# Altium schematic sheet Sheet2.SchDoc
size A4; SheetNumber: 1; SheetTotal: 1; SPICEModelCacheLWHNMWQJ: <root> / <DocumentId>LWHNMWQJ</DocumentId> / <CacheFrame Number="0"> / <Model Name="zener" Kind="MDL"> / <Text>*ZENER / *Default Zener 10V @ 10mA / *Zener Diode Pinout: A,K / .MODEL ZENER D( BV=10 IBV=10E-3 )</Text> / </Model> / </CacheFrame> / </root>
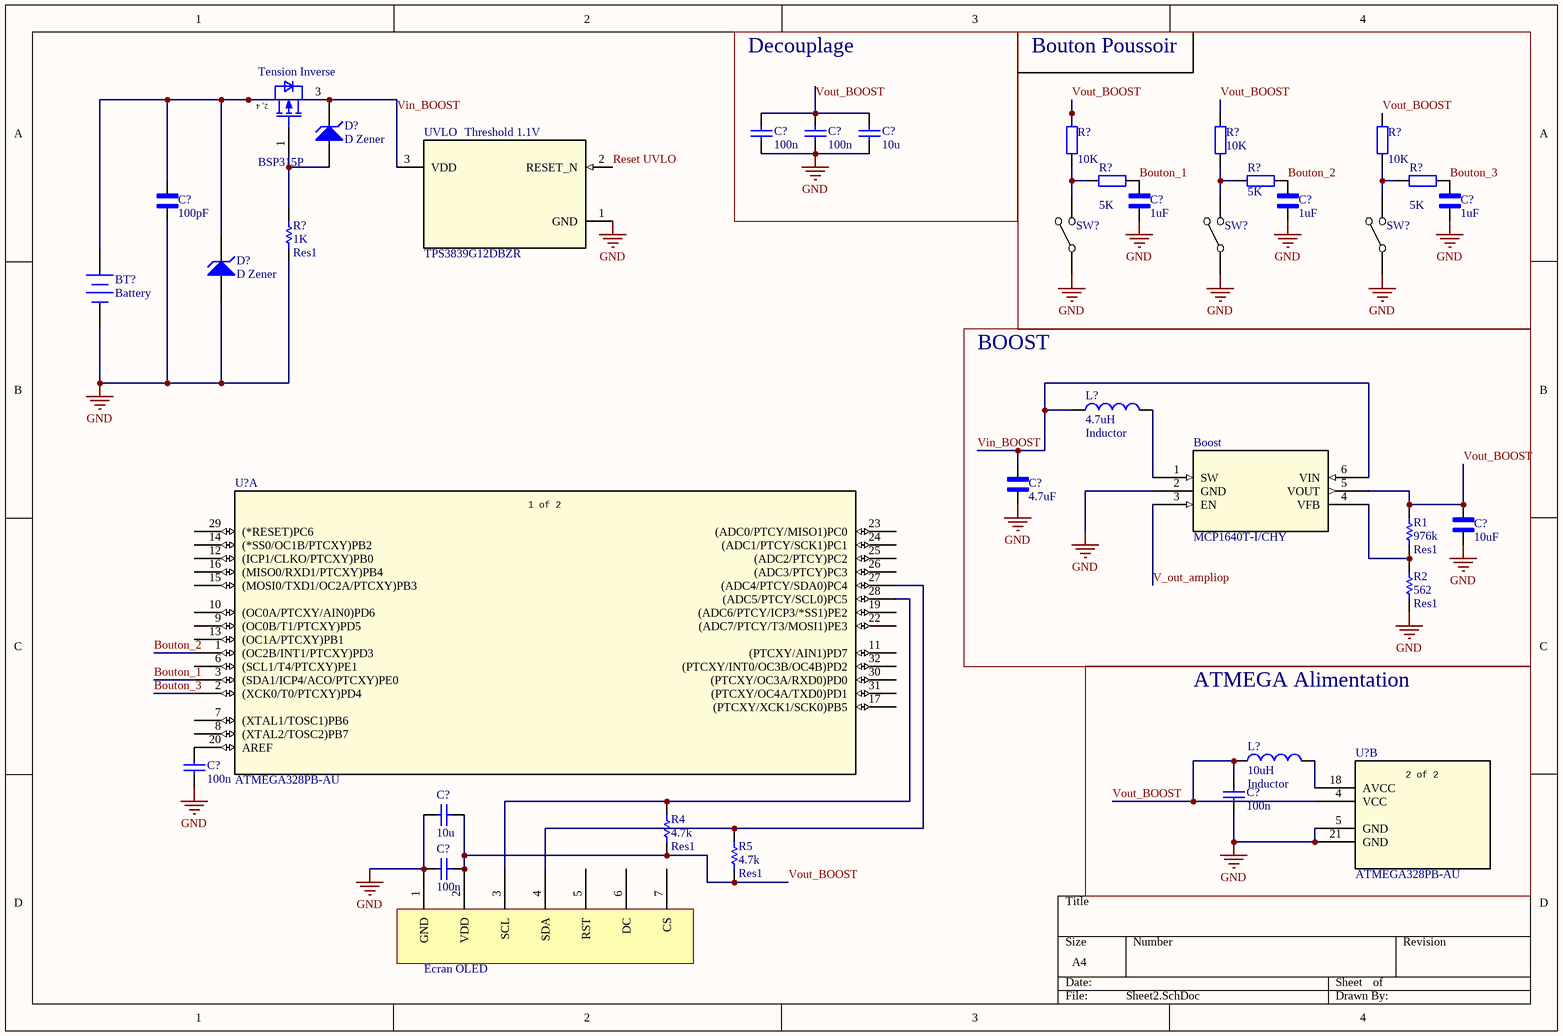
[diagram p0: Sheet2.SchDoc]

## Parts
(Parts that share a designator on the sheet are numbered #1, #2 ... from top to bottom, then left to right.)
?  (no value)
Boost  MCP1640T-I/CHY  [SOT-23-6_MC_MCH]
BT?  Battery  [BAT-2]
C?#1  value 100n  (hidden comment: Capacitor)
C?#2  value 100n  (hidden comment: Capacitor)
C?#3  value 10u  (hidden comment: Capacitor)
C?#4  100pF  [CAPC1608X90N]
C?#5  1uF  [CAPC1005X55N]
C?#6  1uF  [CAPC1005X55N]
C?#7  1uF  [CAPC1005X55N]
C?#8  4.7uF  [CAPC1608X100N]
C?#9  10uF  [CAPC1005X70N]
C?#10  value 100n  (hidden comment: Capacitor)
C?#11  value 10u  (hidden comment: Capacitor)
C?#12  value 100n  (hidden comment: Capacitor)
C?#13  value 100n  (hidden comment: Capacitor)
D?#1  D Zener  [DIODE-0.7]
D?#2  D Zener  [DIODE-0.7]
L?#1  Inductor  value 4.7uH  [0402-A]
L?#2  Inductor  value 10uH  [0402-A]
R1  Res1  value 976k  [AXIAL-0.3]
R2  Res1  value 562  [AXIAL-0.3]
R4  Res1  value 4.7k  [AXIAL-0.3]
R5  Res1  value 4.7k  [AXIAL-0.3]
R?#1  value 10K  [AXIAL-0.4]  (hidden comment: Res2)
R?#2  value 10K  [AXIAL-0.4]  (hidden comment: Res2)
R?#3  value 10K  [AXIAL-0.4]  (hidden comment: Res2)
R?#4  value 5K  [AXIAL-0.4]  (hidden comment: Res2)
R?#5  value 5K  [AXIAL-0.4]  (hidden comment: Res2)
R?#6  value 5K  [AXIAL-0.4]  (hidden comment: Res2)
R?#7  Res1  value 1K  [AXIAL-0.3]
SW?#1  Button  [BUTTON_SPST_WS-TATV]  (value not drawn)
SW?#2  Button  [BUTTON_SPST_WS-TATV]  (value not drawn)
SW?#3  Button  [BUTTON_SPST_WS-TATV]  (value not drawn)
Tension_Inverse  BSP315P
U?#1  ATMEGA328PB-AU  [32A_MCH]  (part A of 2)
U?#2  ATMEGA328PB-AU  [32A_MCH]  (part B of 2)
UVLO  TPS3839G12DBZR  [DBZ0003A_N]

## Blocks framed on the sheet
Decouplage: C?#1-C?#3
Bouton Poussoir: C?#5-C?#7 R?#1-R?#6 SW?#1-SW?#3
BOOST: Boost C?#8 C?#9 L?#1 R1 R2
ATMEGA Alimentation: C?#12 L?#2 U?#2

## Nets
GND: ?.1(GND) Boost.2(GND) BT?.2(-) C?#1.1 C?#2.1 C?#3.1 C?#4.1 C?#5.1 C?#6.1 C?#7.1 C?#8.2 C?#9.1 C?#10.1 C?#11.2 C?#12.1 C?#13.2 D?#2.1(A) R2.1 R?#7.1 SW?#1.1 SW?#2.1 SW?#3.1 U?#2.5(GND) U?#2.21(GND) UVLO.1(GND)
Bouton_1: C?#5.2 R?#4.2 U?#1.3((SDA1/ICP4/ACO/PTCXY)PE0)
Bouton_2: C?#6.2 R?#5.2 U?#1.1((OC2B/INT1/PTCXY)PD3)
Bouton_3: C?#7.2 R?#6.2 U?#1.2((XCK0/T0/PTCXY)PD4)
Reset UVLO: UVLO.2(RESET_N)
V_out_ampliop: Boost.3(EN)
Vin_BOOST: Boost.6(VIN) BT?.1(+) C?#4.2 C?#8.1 D?#1.2(K) D?#2.2(K) L?#1.1 Tension_Inverse.2(DRAIN) Tension_Inverse.3(SOURCE) Tension_Inverse.4(DRAIN) UVLO.3(VDD)
Vout_BOOST: ?.2(VDD) Boost.5(VOUT) C?#1.2 C?#2.2 C?#3.2 C?#9.2 C?#11.1 C?#12.2 C?#13.1 L?#2.1 R1.2 R4.1 R5.1 R?#1.2 R?#2.2 R?#3.2 U?#2.4(VCC)
Net?_3: ?.3(SCL) R4.2 U?#1.28((ADC5/PTCY/SCL0)PC5)
Net?_4: ?.4(SDA) R5.2 U?#1.27((ADC4/PTCY/SDA0)PC4)
NetBoost_1: Boost.1(SW) L?#1.2
NetBoost_4: Boost.4(VFB) R1.1 R2.2
NetC?#10_2: C?#10.2 U?#1.20(AREF)
NetD?#1_1: D?#1.1(A) R?#7.2 Tension_Inverse.1(GATE)
NetL?#2_2: L?#2.2 U?#2.18(AVCC)
NetR?#1_1: R?#1.1 R?#4.1 SW?#1.2
NetR?#2_1: R?#2.1 R?#5.1 SW?#2.2
NetR?#3_1: R?#3.1 R?#6.1 SW?#3.2

Not connected (* = marked no-connect by the designer): ? 5(RST) 6(DC) 7(CS); U?#1 6((SCL1/T4/PTCXY)PE1) 7((XTAL1/TOSC1)PB6) 8((XTAL2/TOSC2)PB7) 9((OC0B/T1/PTCXY)PD5) 10((OC0A/PTCXY/AIN0)PD6) 11((PTCXY/AIN1)PD7) 12((ICP1/CLKO/PTCXY)PB0) 13((OC1A/PTCXY)PB1) 14((*SS0/OC1B/PTCXY)PB2) 15((MOSI0/TXD1/OC2A/PTCXY)PB3) 16((MISO0/RXD1/PTCXY)PB4) 17((PTCXY/XCK1/SCK0)PB5) 19((ADC6/PTCY/ICP3/*SS1)PE2) 22((ADC7/PTCY/T3/MOSI1)PE3) 23((ADC0/PTCY/MISO1)PC0) 24((ADC1/PTCY/SCK1)PC1) 25((ADC2/PTCY)PC2) 26((ADC3/PTCY)PC3) 29((*RESET)PC6) 30((PTCXY/OC3A/RXD0)PD0) 31((PTCXY/OC4A/TXD0)PD1) 32((PTCXY/INT0/OC3B/OC4B)PD2)

## Notes on the sheet
- (near UVLO) Threshold 1.1V
- (in symbol ATMEGA328PB-AU, part A) 1 of 2
- (in symbol ATMEGA328PB-AU, part B) 2 of 2
- (in symbol BSP315P) 2, 4
- (in symbol Component_1) Ecran OLED

## Library data of the parts
? = Component_1
Boost = MCP1640T-ICHY: Description; Manufacturer_Name: Microchip; Copyright: Copyright (C) 2025 Ultra Librarian. All rights reserved.; Manufacturer_Part_Number: MCP1640T-I/CHY; RefDes: RefDes; Type: Type
BT? = Battery: Multicell Battery; Published: 24-Mar-1999; LatestRevisionDate: 17-Jul-2002; LatestRevisionNote: Re-released for DXP Platform.; PackageReference: BAT-2; Publisher: Altium Limited; PackageDescription: Battery; 2 Leads
C?#1-C?#3 C?#10-C?#13 = Capacitor: SimulationGenericComponent: True
C?#4 = GRM1885C1H101JA01D: SMD Capacitor C0G(EIA) with Capacitance: 100pF Tol. 5%. Rated Voltage: 50Vdc; MF: Murata Electronics; SnapEDA_Link: https://www.snapeda.com/parts/GRM1885C1H101JA01D/Murata+Electronics+North+America/view-part/?ref=snap; Package: 1608 Murata; Value: *; MP: GRM1885C1H101JA01D; Check_prices: https://www.snapeda.com/parts/GRM1885C1H101JA01D/Murata+Electronics+North+America/view-part/?ref=eda
C?#5-C?#7 = EMK105BJ105KV-F: 1 ÂµF Â±10% 16V Ceramic Capacitor X5R 0402 (1005 Metric); MF: Taiyo Yuden; SnapEDA_Link: https://www.snapeda.com/parts/EMK105BJ105KV-F/Taiyo+Yuden/view-part/?ref=snap; Package: 1005 Taiyo Yuden; Value: *; MP: EMK105BJ105KV-F; Check_prices: https://www.snapeda.com/parts/EMK105BJ105KV-F/Taiyo+Yuden/view-part/?ref=eda
C?#8 = GRM188R61E475KE11D: Ceramic capacitor SMD 0603 4.7 ÂµF 25 V 10 % (L x W x H) 1.6 x 0.8 x 0.8 mm Murata GRM188R61E475KE11D 4000 pc(s); MF: Murata Electronics; SnapEDA_Link: https://www.snapeda.com/parts/GRM188R61E475KE11D/Murata+Electronics+North+America/view-part/?ref=snap; Package: 1608 Murata; Value: *; MP: GRM188R61E475KE11D; Check_prices: https://www.snapeda.com/parts/GRM188R61E475KE11D/Murata+Electronics+North+America/view-part/?ref=eda
C?#9 = GRM155R61A106ME11D: SMD capacitor X5R(EIA) with capacitance 10uF Tol.20%. Rated voltage 10Vdc 85C; MF: Murata Electronics; SnapEDA_Link: https://www.snapeda.com/parts/GRM155R61A106ME11D/Murata/view-part/?ref=snap; Package: 1005 Murata; Value: *; MP: GRM155R61A106ME11D; Check_prices: https://www.snapeda.com/parts/GRM155R61A106ME11D/Murata/view-part/?ref=eda
D?#1 D?#2 = D Zener: Zener Diode; Published: 8-Jun-2000; LatestRevisionDate: 17-Jul-2002; LatestRevisionNote: Re-released for DXP Platform.; PackageReference: DIODE-0.7; Publisher: Altium Limited; PackageDescription: Diode, Thru-Hole; 2 Leads; 0.7 in Pin Spacing
L?#1 L?#2 = Inductor: Code_IEC: 1005; Published: 8-Jun-2000; LatestRevisionDate: 29-May-2009; LatestRevisionNote: IPC-7351 Footprint Added.; PackageReference: 0402-A; Publisher: Altium Limited; PackageDescription: Chip Inductor; Code_JEITA: 0402
R1 R2 R4 R5 R?#7 = Res1: Resistor; Published: 8-Jun-2000; LatestRevisionDate: 17-Jul-2002; LatestRevisionNote: Re-released for DXP Platform.; PackageReference: AXIAL-0.3; Publisher: Altium Limited; PackageDescription: Axial Device, Thru-Hole; 2 Leads; 0.3 in Pin Spacing
R?#1-R?#6 = Res2: Resistor; Published: 8-Jun-2000; LatestRevisionDate: 17-Jul-2002; LatestRevisionNote: Re-released for DXP Platform.; PackageReference: AXIAL-0.4; Publisher: Altium Limited; PackageDescription: Axial Device, Thru-Hole; 2 Leads; 0.4 in Pin Spacing
SW?#1-SW?#3 = BTN_SPST: SPST Button; Mfg: Wurth; Mfg_PN: 430186070716; Supplier1: Digikey; Supplier1_PN: 430186070716-ND
Tension_Inverse = BSP315P: OptiMOS-P Small-Signal-Transistor, VDS -60V, ID -3A; Manufacturer: Infineon Technologies; ManufacturerPartNumber: BSP315P; PackageReference: PG-SOT223-4-21
U?#1 U?#2 = ATMEGA328PB-AU: Description; Manufacturer_Name: Microchip; Copyright: Copyright (C) 2025 Ultra Librarian. All rights reserved.; Manufacturer_Part_Number: ATMEGA328PB-AU; RefDes: RefDes; Type: Type
UVLO = TPS3839G12DBZR: Ultra-low power, supply voltage supervisor 3-SOT-23 -40 to 85; Manufacturer_Name: Texas Instruments; TYPE: TYPE; RefDes: RefDes; Copyright: Copyright (C) 2026 Ultra Librarian. All rights reserved.; Manufacturer_Part_Number: TPS3839G12DBZR; Datasheet: https://www.ti.com/lit/gpn/tps3839; Digi-Key_Part_Number_1: 296-40759-1-ND; Digi-Key_Part_Number_2: 296-40759-2-ND; Digi-Key_Part_Number_3: 296-40759-6-ND; Digi-Key_Part_Number_4: TPS3839G12DBZR-ND; Digi-Key_Part_Number_5: 2156-TPS3839G12DBZR-ND